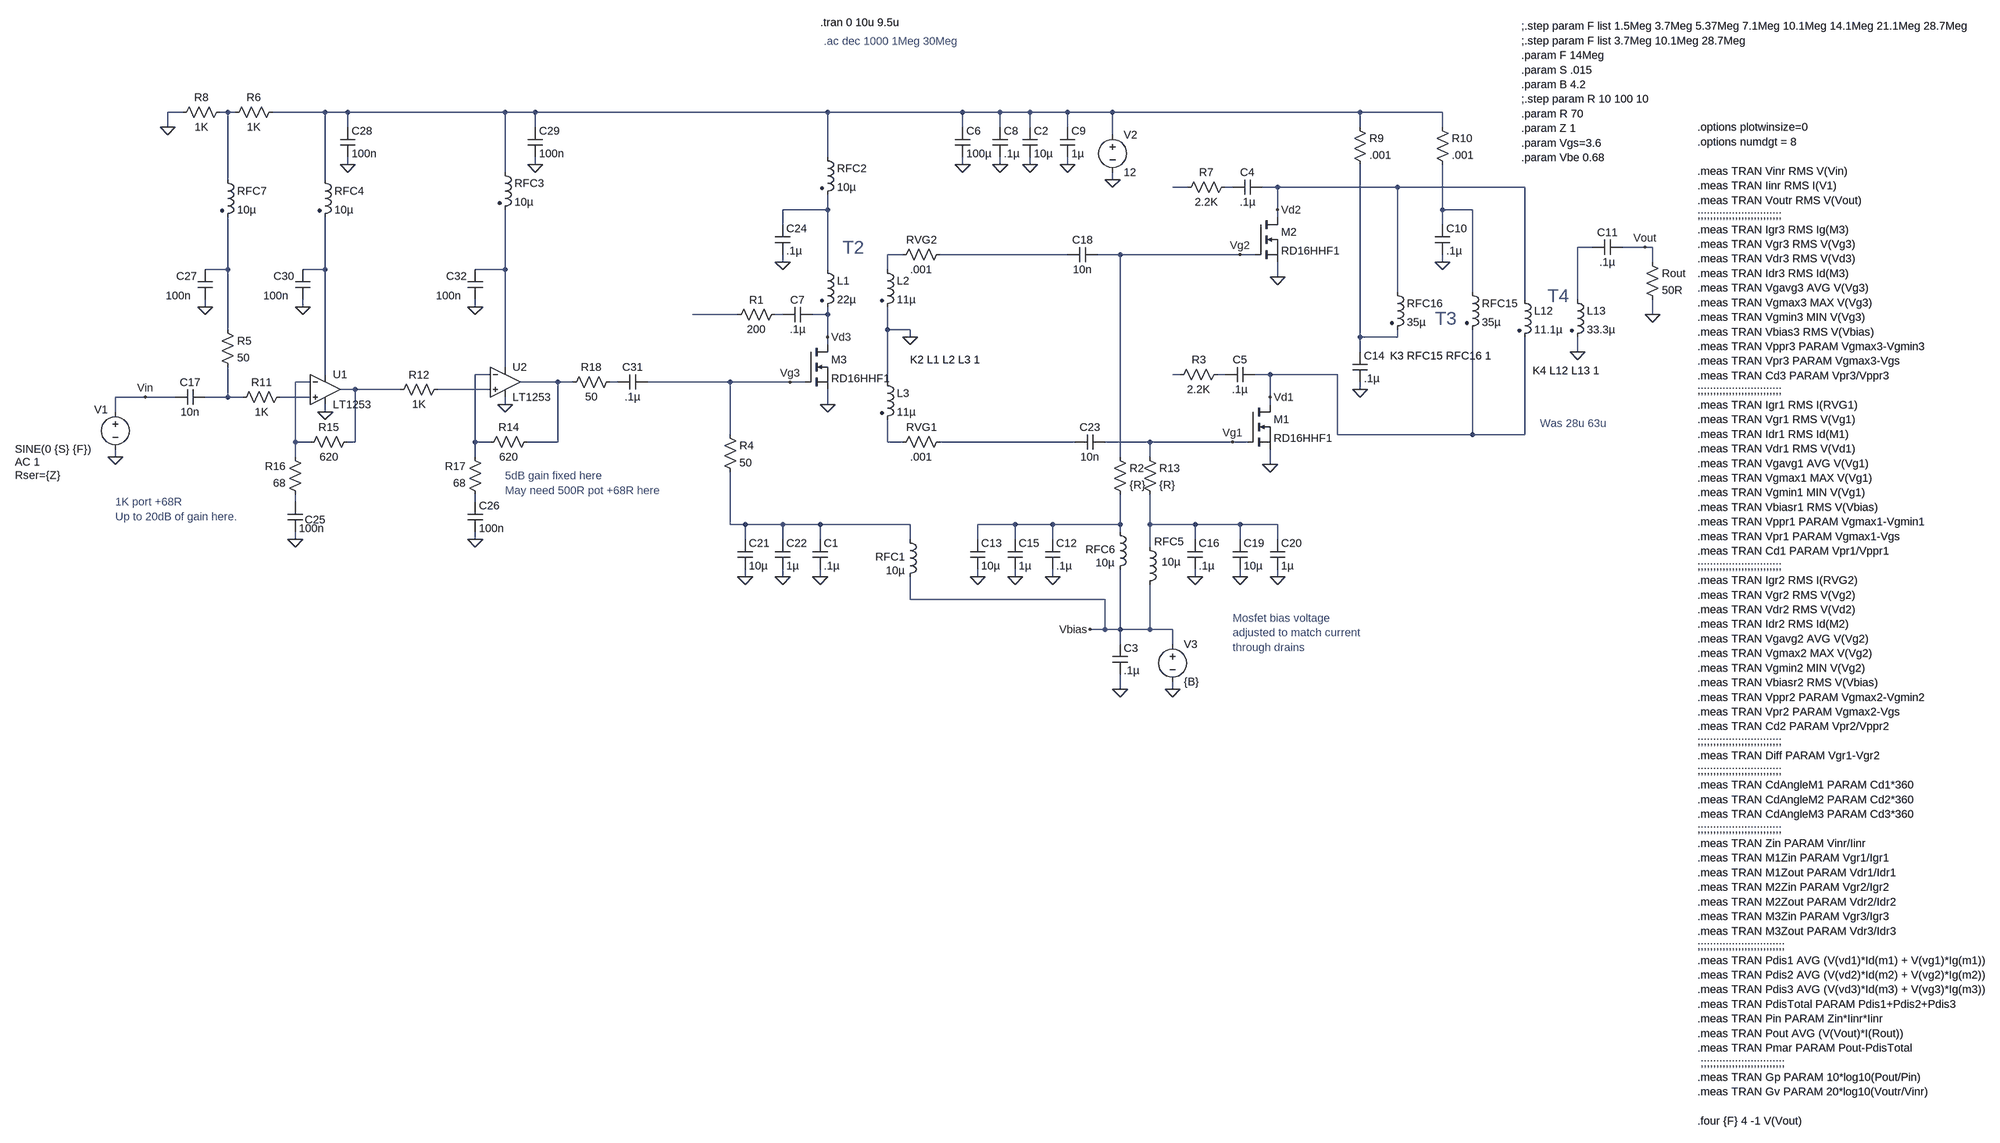
[diagram p0: schematic LT1253 2SC5706 RD16HHF Testing.asc]
LT1253 2SC5706 RD16HHF Testing.asc, the LTspice schematic file:
Version 4
SHEET 1 3748 1496
WIRE -880 -624 -912 -624
WIRE -784 -624 -800 -624
WIRE -768 -624 -784 -624
WIRE -576 -624 -688 -624
WIRE -528 -624 -576 -624
WIRE -192 -624 -528 -624
WIRE -128 -624 -192 -624
WIRE 496 -624 -128 -624
WIRE 784 -624 496 -624
WIRE 864 -624 784 -624
WIRE 928 -624 864 -624
WIRE 1008 -624 928 -624
WIRE 1104 -624 1008 -624
WIRE 1632 -624 1104 -624
WIRE 1808 -624 1632 -624
WIRE -912 -592 -912 -624
WIRE -528 -592 -528 -624
WIRE -128 -592 -128 -624
WIRE 784 -592 784 -624
WIRE 864 -592 864 -624
WIRE 928 -592 928 -624
WIRE 1008 -592 1008 -624
WIRE 1632 -592 1632 -624
WIRE 1808 -592 1808 -624
WIRE 1104 -576 1104 -624
WIRE 496 -528 496 -624
WIRE -528 -512 -528 -528
WIRE -128 -512 -128 -528
WIRE 784 -512 784 -528
WIRE 864 -512 864 -528
WIRE 928 -512 928 -528
WIRE 1008 -512 1008 -528
WIRE -192 -496 -192 -624
WIRE -784 -480 -784 -624
WIRE -576 -480 -576 -624
WIRE 1104 -480 1104 -496
WIRE 1264 -464 1232 -464
WIRE 1360 -464 1344 -464
WIRE 1456 -464 1424 -464
WIRE 1712 -464 1456 -464
WIRE 1984 -464 1712 -464
WIRE 496 -416 496 -448
WIRE 496 -416 400 -416
WIRE 1456 -416 1456 -464
WIRE 1808 -416 1808 -512
WIRE 1872 -416 1808 -416
WIRE 1456 -400 1456 -416
WIRE 400 -384 400 -416
WIRE 1808 -384 1808 -416
WIRE 2128 -336 2096 -336
WIRE 2240 -336 2192 -336
WIRE 2256 -336 2240 -336
WIRE 656 -320 624 -320
WIRE 1008 -320 736 -320
WIRE 1120 -320 1072 -320
WIRE 1376 -320 1120 -320
WIRE 1408 -320 1376 -320
WIRE 400 -304 400 -320
WIRE 1808 -304 1808 -320
WIRE 2256 -304 2256 -336
WIRE -784 -288 -784 -400
WIRE -784 -288 -832 -288
WIRE -576 -288 -576 -400
WIRE -576 -288 -624 -288
WIRE -192 -288 -192 -416
WIRE -192 -288 -256 -288
WIRE 496 -288 496 -416
WIRE 624 -288 624 -320
WIRE 1456 -272 1456 -304
WIRE 1712 -240 1712 -464
WIRE 1872 -240 1872 -416
WIRE 1984 -224 1984 -464
WIRE 2096 -224 2096 -336
WIRE -832 -208 -832 -224
WIRE -624 -208 -624 -224
WIRE -256 -208 -256 -224
WIRE 304 -192 208 -192
WIRE 400 -192 384 -192
WIRE 496 -192 496 -208
WIRE 496 -192 464 -192
WIRE 2256 -192 2256 -224
WIRE -784 -160 -784 -288
WIRE 624 -160 624 -208
WIRE 672 -160 624 -160
WIRE 496 -144 496 -192
WIRE 672 -144 672 -160
WIRE 1632 -144 1632 -512
WIRE 1712 -144 1712 -160
WIRE 1712 -144 1632 -144
WIRE 496 -128 496 -144
WIRE 1632 -112 1632 -144
WIRE 2096 -112 2096 -144
WIRE -192 -80 -192 -288
WIRE -576 -64 -576 -288
WIRE -224 -64 -256 -64
WIRE 1248 -64 1232 -64
WIRE 1344 -64 1328 -64
WIRE 1440 -64 1408 -64
WIRE 1584 -64 1440 -64
WIRE -608 -48 -640 -48
WIRE -80 -48 -160 -48
WIRE -48 -48 -80 -48
WIRE 48 -48 32 -48
WIRE 288 -48 112 -48
WIRE 416 -48 288 -48
WIRE 448 -48 416 -48
WIRE 624 -48 624 -160
WIRE -512 -32 -544 -32
WIRE -416 -32 -512 -32
WIRE -224 -32 -336 -32
WIRE 1632 -32 1632 -48
WIRE -960 -16 -1024 -16
WIRE -896 -16 -960 -16
WIRE -784 -16 -784 -80
WIRE -784 -16 -832 -16
WIRE -752 -16 -784 -16
WIRE -608 -16 -672 -16
WIRE 1440 -16 1440 -64
WIRE -192 0 -192 -16
WIRE 496 0 496 -32
WIRE 1440 0 1440 -16
WIRE -1024 16 -1024 -16
WIRE -576 16 -576 0
WIRE 288 64 288 -48
WIRE 1584 64 1584 -64
WIRE 1872 64 1872 -160
WIRE 1872 64 1584 64
WIRE 1984 64 1984 -144
WIRE 1984 64 1872 64
WIRE -640 80 -640 -48
WIRE -608 80 -640 80
WIRE -512 80 -512 -32
WIRE -512 80 -528 80
WIRE -256 80 -256 -64
WIRE -224 80 -256 80
WIRE -80 80 -80 -48
WIRE -80 80 -144 80
WIRE 624 80 624 32
WIRE 656 80 624 80
WIRE 1024 80 736 80
WIRE 1184 80 1088 80
WIRE 1360 80 1184 80
WIRE 1392 80 1360 80
WIRE -1024 112 -1024 96
WIRE -640 112 -640 80
WIRE -256 112 -256 80
WIRE 1120 112 1120 -320
WIRE 1184 112 1184 80
WIRE 1440 128 1440 96
WIRE -640 208 -640 192
WIRE -256 208 -256 192
WIRE 288 256 288 144
WIRE 320 256 288 256
WIRE 400 256 320 256
WIRE 480 256 400 256
WIRE 672 256 480 256
WIRE 896 256 816 256
WIRE 976 256 896 256
WIRE 1120 256 1120 192
WIRE 1120 256 976 256
WIRE 1184 256 1184 192
WIRE 1280 256 1184 256
WIRE 1376 256 1280 256
WIRE 1456 256 1376 256
WIRE 1120 272 1120 256
WIRE -640 288 -640 272
WIRE -256 288 -256 272
WIRE 320 288 320 256
WIRE 400 288 400 256
WIRE 480 288 480 256
WIRE 672 288 672 256
WIRE 816 288 816 256
WIRE 896 288 896 256
WIRE 976 288 976 256
WIRE 1280 288 1280 256
WIRE 1376 288 1376 256
WIRE 1456 288 1456 256
WIRE 1184 304 1184 256
WIRE 320 368 320 352
WIRE 400 368 400 352
WIRE 480 368 480 352
WIRE 816 368 816 352
WIRE 896 368 896 352
WIRE 976 368 976 352
WIRE 1280 368 1280 352
WIRE 1376 368 1376 352
WIRE 1456 368 1456 352
WIRE 672 416 672 368
WIRE 1088 416 672 416
WIRE 1088 480 1088 416
WIRE 1088 480 1056 480
WIRE 1120 480 1120 352
WIRE 1120 480 1088 480
WIRE 1184 480 1184 384
WIRE 1184 480 1120 480
WIRE 1232 480 1184 480
WIRE 1120 512 1120 480
WIRE 1232 512 1232 480
WIRE 1120 608 1120 576
WIRE 1232 608 1232 592
FLAG 1104 -480 0
FLAG -1024 112 0
FLAG 2240 -336 Vout
FLAG -960 -16 Vin
FLAG 928 -512 0
FLAG 1008 -512 0
FLAG 784 -512 0
FLAG 864 -512 0
FLAG 1232 608 0
FLAG 1440 128 0
FLAG 1360 80 Vg1
FLAG 1440 -16 Vd1
FLAG 1120 608 0
FLAG 1056 480 Vbias
FLAG 1456 -272 0
FLAG 1376 -320 Vg2
FLAG 1456 -416 Vd2
FLAG 1808 -304 0
FLAG 2096 -112 0
FLAG 2256 -192 0
FLAG 1632 -32 0
FLAG 480 368 0
FLAG 1280 368 0
FLAG 1376 368 0
FLAG 1456 368 0
FLAG 320 368 0
FLAG 400 368 0
FLAG 496 0 0
FLAG 416 -48 Vg3
FLAG 496 -144 Vd3
FLAG 976 368 0
FLAG 816 368 0
FLAG 896 368 0
FLAG 400 -304 0
FLAG 672 -144 0
FLAG -528 -512 0
FLAG -832 -208 0
FLAG -576 16 0
FLAG -192 0 0
FLAG -256 288 0
FLAG -128 -512 0
FLAG -912 -592 0
FLAG -640 288 0
FLAG -624 -208 0
FLAG -256 -208 0
SYMBOL voltage -1024 0 R0
WINDOW 0 -45 11 Left 2
WINDOW 3 -214 95 Left 2
WINDOW 123 -214 123 Left 2
WINDOW 39 -214 151 Left 2
SYMATTR InstName V1
SYMATTR Value SINE(0 {S} {F})
SYMATTR Value2 AC 1
SYMATTR SpiceLine Rser={Z}
SYMBOL voltage 1104 -592 R0
WINDOW 123 0 0 Left 0
WINDOW 39 0 0 Left 0
SYMATTR InstName V2
SYMATTR Value 12
SYMBOL res 2240 -320 R0
SYMATTR InstName Rout
SYMATTR Value 50R
SYMBOL ind2 608 -304 R0
SYMATTR InstName L2
SYMATTR Value 11µ
SYMATTR Type ind
SYMBOL cap 912 -592 R0
SYMATTR InstName C2
SYMATTR Value 10µ
SYMBOL cap 992 -592 R0
SYMATTR InstName C9
SYMATTR Value 1µ
SYMBOL cap 768 -592 R0
SYMATTR InstName C6
SYMATTR Value 100µ
SYMBOL cap 848 -592 R0
SYMATTR InstName C8
SYMATTR Value .1µ
SYMBOL voltage 1232 496 R0
WINDOW 123 0 0 Left 2
WINDOW 39 0 0 Left 2
SYMATTR InstName V3
SYMATTR Value {B}
SYMBOL res 1104 96 R0
SYMATTR InstName R2
SYMATTR Value {R}
SYMBOL nmos 1392 0 R0
SYMATTR InstName M1
SYMATTR Value RD16HHF1
SYMBOL cap 1104 512 R0
SYMATTR InstName C3
SYMATTR Value .1µ
SYMBOL nmos 1408 -400 R0
SYMATTR InstName M2
SYMATTR Value RD16HHF1
SYMBOL ind2 1968 -240 R0
SYMATTR InstName L12
SYMATTR Value 11.1µ
SYMATTR Type ind
SYMBOL ind2 1856 -256 R0
SYMATTR InstName RFC15
SYMATTR Value 35µ
SYMATTR Type ind
SYMBOL cap 1792 -384 R0
SYMATTR InstName C10
SYMATTR Value .1µ
SYMBOL cap 2192 -352 R90
WINDOW 0 0 32 VBottom 2
WINDOW 3 32 32 VTop 2
SYMATTR InstName C11
SYMATTR Value .1µ
SYMBOL cap 1616 -112 R0
SYMATTR InstName C14
SYMATTR Value .1µ
SYMBOL ind2 1696 -256 R0
SYMATTR InstName RFC16
SYMATTR Value 35µ
SYMATTR Type ind
SYMBOL ind2 2080 -240 R0
SYMATTR InstName L13
SYMATTR Value 33.3µ
SYMATTR Type ind
SYMBOL res 1616 -608 R0
SYMATTR InstName R9
SYMATTR Value .001
SYMBOL res 1792 -608 R0
SYMATTR InstName R10
SYMATTR Value .001
SYMBOL res 752 64 R90
WINDOW 0 0 56 VBottom 2
WINDOW 3 32 56 VTop 2
SYMATTR InstName RVG1
SYMATTR Value .001
SYMBOL res 752 -336 R90
WINDOW 0 0 56 VBottom 2
WINDOW 3 32 56 VTop 2
SYMATTR InstName RVG2
SYMATTR Value .001
SYMBOL cap 1424 -480 R90
WINDOW 0 0 32 VBottom 2
WINDOW 3 32 32 VTop 2
SYMATTR InstName C4
SYMATTR Value .1µ
SYMBOL cap 1408 -80 R90
WINDOW 0 0 32 VBottom 2
WINDOW 3 32 32 VTop 2
SYMATTR InstName C5
SYMATTR Value .1µ
SYMBOL res 1344 -80 R90
WINDOW 0 0 56 VBottom 2
WINDOW 3 32 56 VTop 2
SYMATTR InstName R3
SYMATTR Value 2.2K
SYMBOL res 1360 -480 R90
WINDOW 0 0 56 VBottom 2
WINDOW 3 32 56 VTop 2
SYMATTR InstName R7
SYMATTR Value 2.2K
SYMBOL res 1168 96 R0
SYMATTR InstName R13
SYMATTR Value {R}
SYMBOL ind 1168 288 R0
WINDOW 0 25 5 Left 2
WINDOW 3 41 48 Left 2
SYMATTR InstName RFC5
SYMATTR Value 10µ
SYMBOL ind 1104 256 R0
WINDOW 0 -58 53 Left 2
WINDOW 3 -36 82 Left 2
SYMATTR InstName RFC6
SYMATTR Value 10µ
SYMBOL cap 464 288 R0
SYMATTR InstName C1
SYMATTR Value .1µ
SYMBOL cap 1264 288 R0
SYMATTR InstName C16
SYMATTR Value .1µ
SYMBOL cap 1360 288 R0
SYMATTR InstName C19
SYMATTR Value 10µ
SYMBOL cap 1440 288 R0
SYMATTR InstName C20
SYMATTR Value 1µ
SYMBOL cap 304 288 R0
SYMATTR InstName C21
SYMATTR Value 10µ
SYMBOL cap 384 288 R0
SYMATTR InstName C22
SYMATTR Value 1µ
SYMBOL nmos 448 -128 R0
SYMATTR InstName M3
SYMATTR Value RD16HHF1
SYMBOL cap 464 -208 R90
WINDOW 0 0 32 VBottom 2
WINDOW 3 32 32 VTop 2
SYMATTR InstName C7
SYMATTR Value .1µ
SYMBOL res 400 -208 R90
WINDOW 0 0 56 VBottom 2
WINDOW 3 32 56 VTop 2
SYMATTR InstName R1
SYMATTR Value 200
SYMBOL ind2 480 -304 R0
SYMATTR InstName L1
SYMATTR Value 22µ
SYMATTR Type ind
SYMBOL res 272 48 R0
SYMATTR InstName R4
SYMATTR Value 50
SYMBOL cap 960 288 R0
SYMATTR InstName C12
SYMATTR Value .1µ
SYMBOL cap 800 288 R0
SYMATTR InstName C13
SYMATTR Value 10µ
SYMBOL cap 880 288 R0
SYMATTR InstName C15
SYMATTR Value 1µ
SYMBOL cap -832 -32 R90
WINDOW 0 0 32 VBottom 2
WINDOW 3 32 32 VTop 2
SYMATTR InstName C17
SYMATTR Value 10n
SYMBOL cap 1072 -336 R90
WINDOW 0 0 32 VBottom 2
WINDOW 3 32 32 VTop 2
SYMATTR InstName C18
SYMATTR Value 10n
SYMBOL cap 1088 64 R90
WINDOW 0 0 32 VBottom 2
WINDOW 3 32 32 VTop 2
SYMATTR InstName C23
SYMATTR Value 10n
SYMBOL ind 656 272 R0
WINDOW 0 -58 53 Left 2
WINDOW 3 -36 82 Left 2
SYMATTR InstName RFC1
SYMATTR Value 10µ
SYMBOL ind2 480 -544 R0
SYMATTR InstName RFC2
SYMATTR Value 10µ
SYMATTR Type ind
SYMBOL cap 384 -384 R0
SYMATTR InstName C24
SYMATTR Value .1µ
SYMBOL ind2 608 -64 R0
SYMATTR InstName L3
SYMATTR Value 11µ
SYMATTR Type ind
SYMBOL Opamps\\LT1253 -576 -96 R0
SYMATTR InstName U1
SYMBOL Opamps\\LT1253 -192 -112 R0
SYMATTR InstName U2
SYMBOL res -800 -176 R0
SYMATTR InstName R5
SYMATTR Value 50
SYMBOL res -672 -640 R90
WINDOW 0 0 56 VBottom 2
WINDOW 3 32 56 VTop 2
SYMATTR InstName R6
SYMATTR Value 1K
SYMBOL res -784 -640 R90
WINDOW 0 0 56 VBottom 2
WINDOW 3 32 56 VTop 2
SYMATTR InstName R8
SYMATTR Value 1K
SYMBOL res -656 -32 R90
WINDOW 0 0 56 VBottom 2
WINDOW 3 32 56 VTop 2
SYMATTR InstName R11
SYMATTR Value 1K
SYMBOL res -320 -48 R90
WINDOW 0 0 56 VBottom 2
WINDOW 3 32 56 VTop 2
SYMATTR InstName R12
SYMATTR Value 1K
SYMBOL res -128 64 R90
WINDOW 0 0 56 VBottom 2
WINDOW 3 32 56 VTop 2
SYMATTR InstName R14
SYMATTR Value 620
SYMBOL res -512 64 R90
WINDOW 0 0 56 VBottom 2
WINDOW 3 32 56 VTop 2
SYMATTR InstName R15
SYMATTR Value 620
SYMBOL res -624 208 R180
WINDOW 0 36 76 Left 2
WINDOW 3 36 40 Left 2
SYMATTR InstName R16
SYMATTR Value 68
SYMBOL res -240 208 R180
WINDOW 0 36 76 Left 2
WINDOW 3 36 40 Left 2
SYMATTR InstName R17
SYMATTR Value 68
SYMBOL cap -656 208 R0
WINDOW 0 36 38 Left 2
SYMATTR InstName C25
SYMATTR Value 100n
SYMBOL cap -272 208 R0
SYMATTR InstName C26
SYMATTR Value 100n
SYMBOL cap -848 -288 R0
WINDOW 0 -46 14 Left 2
WINDOW 3 -68 56 Left 2
SYMATTR InstName C27
SYMATTR Value 100n
SYMBOL cap -544 -592 R0
SYMATTR InstName C28
SYMATTR Value 100n
SYMBOL cap -144 -592 R0
SYMATTR InstName C29
SYMATTR Value 100n
SYMBOL res 48 -64 R90
WINDOW 0 0 56 VBottom 2
WINDOW 3 32 56 VTop 2
SYMATTR InstName R18
SYMATTR Value 50
SYMBOL cap 112 -64 R90
WINDOW 0 0 32 VBottom 2
WINDOW 3 32 32 VTop 2
SYMATTR InstName C31
SYMATTR Value .1µ
SYMBOL ind2 -208 -512 R0
SYMATTR InstName RFC3
SYMATTR Value 10µ
SYMATTR Type ind
SYMBOL ind2 -592 -496 R0
SYMATTR InstName RFC4
SYMATTR Value 10µ
SYMATTR Type ind
SYMBOL ind2 -800 -496 R0
SYMATTR InstName RFC7
SYMATTR Value 10µ
SYMATTR Type ind
SYMBOL cap -640 -288 R0
WINDOW 0 -46 14 Left 2
WINDOW 3 -68 56 Left 2
SYMATTR InstName C30
SYMATTR Value 100n
SYMBOL cap -272 -288 R0
WINDOW 0 -46 14 Left 2
WINDOW 3 -68 56 Left 2
SYMATTR InstName C32
SYMATTR Value 100n
TEXT 480 -816 Left 2 !.tran 0 10u 9.5u
TEXT 2352 -592 Left 2 !.options plotwinsize=0\n.options numdgt = 8\n \n.meas TRAN Vinr RMS V(Vin)\n.meas TRAN Iinr RMS I(V1)\n.meas TRAN Voutr RMS V(Vout)\n;;;;;;;;;;;;;;;;;;;;;;;;;;;\n.meas TRAN Igr3 RMS Ig(M3)\n.meas TRAN Vgr3 RMS V(Vg3)\n.meas TRAN Vdr3 RMS V(Vd3)\n.meas TRAN Idr3 RMS Id(M3)\n.meas TRAN Vgavg3 AVG V(Vg3)\n.meas TRAN Vgmax3 MAX V(Vg3)\n.meas TRAN Vgmin3 MIN V(Vg3)\n.meas TRAN Vbias3 RMS V(Vbias)\n.meas TRAN Vppr3 PARAM Vgmax3-Vgmin3\n.meas TRAN Vpr3 PARAM Vgmax3-Vgs\n.meas TRAN Cd3 PARAM Vpr3/Vppr3\n;;;;;;;;;;;;;;;;;;;;;;;;;;;\n.meas TRAN Igr1 RMS I(RVG1)\n.meas TRAN Vgr1 RMS V(Vg1)\n.meas TRAN Idr1 RMS Id(M1)\n.meas TRAN Vdr1 RMS V(Vd1)\n.meas TRAN Vgavg1 AVG V(Vg1)\n.meas TRAN Vgmax1 MAX V(Vg1)\n.meas TRAN Vgmin1 MIN V(Vg1)\n.meas TRAN Vbiasr1 RMS V(Vbias)\n.meas TRAN Vppr1 PARAM Vgmax1-Vgmin1\n.meas TRAN Vpr1 PARAM Vgmax1-Vgs\n.meas TRAN Cd1 PARAM Vpr1/Vppr1\n;;;;;;;;;;;;;;;;;;;;;;;;;;;\n.meas TRAN Igr2 RMS I(RVG2)\n.meas TRAN Vgr2 RMS V(Vg2)\n.meas TRAN Vdr2 RMS V(Vd2)\n.meas TRAN Idr2 RMS Id(M2)\n.meas TRAN Vgavg2 AVG V(Vg2)\n.meas TRAN Vgmax2 MAX V(Vg2)\n.meas TRAN Vgmin2 MIN V(Vg2)\n.meas TRAN Vbiasr2 RMS V(Vbias)\n.meas TRAN Vppr2 PARAM Vgmax2-Vgmin2\n.meas TRAN Vpr2 PARAM Vgmax2-Vgs\n.meas TRAN Cd2 PARAM Vpr2/Vppr2\n;;;;;;;;;;;;;;;;;;;;;;;;;;;\n.meas TRAN Diff PARAM Vgr1-Vgr2 \n;;;;;;;;;;;;;;;;;;;;;;;;;;;\n.meas TRAN CdAngleM1 PARAM Cd1*360\n.meas TRAN CdAngleM2 PARAM Cd2*360\n.meas TRAN CdAngleM3 PARAM Cd3*360\n;;;;;;;;;;;;;;;;;;;;;;;;;;;\n.meas TRAN Zin PARAM Vinr/Iinr \n.meas TRAN M1Zin PARAM Vgr1/Igr1 \n.meas TRAN M1Zout PARAM Vdr1/Idr1 \n.meas TRAN M2Zin PARAM Vgr2/Igr2 \n.meas TRAN M2Zout PARAM Vdr2/Idr2 \n.meas TRAN M3Zin PARAM Vgr3/Igr3 \n.meas TRAN M3Zout PARAM Vdr3/Idr3 \n;;;;;;;;;;;;;;;;;;;;;;;;;;;;\n.meas TRAN Pdis1 AVG (V(vd1)*Id(m1) + V(vg1)*Ig(m1))\n.meas TRAN Pdis2 AVG (V(vd2)*Id(m2) + V(vg2)*Ig(m2))\n.meas TRAN Pdis3 AVG (V(vd3)*Id(m3) + V(vg3)*Ig(m3))\n.meas TRAN PdisTotal PARAM Pdis1+Pdis2+Pdis3\n.meas TRAN Pin PARAM Zin*Iinr*Iinr\n.meas TRAN Pout AVG (V(Vout)*I(Rout))\n.meas TRAN Pmar PARAM Pout-PdisTotal\n ;;;;;;;;;;;;;;;;;;;;;;;;;;;\n.meas TRAN Gp PARAM 10*log10(Pout/Pin)\n.meas TRAN Gv PARAM 20*log10(Voutr/Vinr)\n \n.four {F} 4 -1 V(Vout)
TEXT 1976 -808 Left 2 !;.step param F list 1.5Meg 3.7Meg 5.37Meg 7.1Meg 10.1Meg 14.1Meg 21.1Meg 28.7Meg\n;.step param F list 3.7Meg 10.1Meg 28.7Meg\n.param F 14Meg\n.param S .015\n.param B 4.2\n;.step param R 10 100 10\n.param R 70\n.param Z 1\n.param Vgs=3.6\n.param Vbe 0.68
TEXT 488 -776 Left 2 ;.ac dec 1000 1Meg 30Meg
TEXT 672 -96 Left 2 !K2 L1 L2 L3 1
TEXT 2000 -72 Left 2 !K4 L12 L13 1
TEXT 1696 -104 Left 2 !K3 RFC15 RFC16 1
TEXT 2016 40 Left 2 ;Was 28u 63u
TEXT 1360 456 Left 2 ;Mosfet bias voltage\nadjusted to match current\nthrough drains
TEXT 528 -336 Left 4 ;T2
TEXT 1792 -184 Left 4 ;T3
TEXT 2032 -232 Left 4 ;T4
TEXT -192 152 Left 2 ;5dB gain fixed here\nMay need 500R pot +68R here
TEXT -1024 208 Left 2 ;1K port +68R  \nUp to 20dB of gain here.

The netlist it stands for:
* LT1253 2SC5706 RD16HHF Testing.asc
V1 Vin 0 SINE(0 {S} {F}) AC 1 Rser={Z}
V2 N002 0 12
Rout Vout 0 50R
L2 N008 0 11µ
C2 N002 0 10µ
C9 N002 0 1µ
C6 N002 0 100µ
C8 N002 0 .1µ
V3 Vbias 0 {B}
R2 Vg2 N031 {R}
M1 Vd1 Vg1 0 0 RD16HHF1
C3 Vbias 0 .1µ
M2 Vd2 Vg2 0 0 RD16HHF1
L12 Vd2 Vd1 11.1µ
L§RFC15 N006 Vd1 35µ
C10 N006 0 .1µ
C11 Vout N007 .1µ
C14 N015 0 .1µ
L§RFC16 Vd2 N015 35µ
L13 N007 0 33.3µ
R9 N002 N015 .001
R10 N002 N006 .001
RVG1 N027 N026 .001
RVG2 N009 N008 .001
C4 Vd2 N004 .1µ
C5 Vd1 N018 .1µ
R3 N018 N017 2.2K
R7 N004 N003 2.2K
R13 Vg1 N032 {R}
L§RFC5 N032 Vbias 10µ
L§RFC6 N031 Vbias 10µ
C1 N030 0 .1µ
C16 N032 0 .1µ
C19 N032 0 10µ
C20 N032 0 1µ
C21 N030 0 10µ
C22 N030 0 1µ
M3 Vd3 Vg3 0 0 RD16HHF1
C7 Vd3 N014 .1µ
R1 N014 N013 200
L1 N005 Vd3 22µ
R4 Vg3 N030 50
C12 N031 0 .1µ
C13 N031 0 10µ
C15 N031 0 1µ
C17 N024 Vin 10n
C18 Vg2 N009 10n
C23 Vg1 N027 10n
L§RFC1 N030 Vbias 10µ
L§RFC2 N002 N005 10µ
C24 N005 0 .1µ
L3 0 N026 11µ
XU1 N025 N019 N011 0 N022 LT1253  ; pins In+ In- V+ V- OUT
XU2 N023 N016 N012 0 N020 LT1253  ; pins In+ In- V+ V- OUT
R5 N010 N024 50
R6 N002 N001 1K
R8 N001 0 1K
R11 N025 N024 1K
R12 N023 N022 1K
R14 N020 N016 620
R15 N022 N019 620
R16 N028 N019 68
R17 N029 N016 68
C25 N028 0 100n
C26 N029 0 100n
C27 N010 0 100n
C28 N002 0 100n
C29 N002 0 100n
R18 N021 N020 50
C31 Vg3 N021 .1µ
L§RFC3 N002 N012 10µ
L§RFC4 N002 N011 10µ
L§RFC7 N001 N010 10µ
C30 N011 0 100n
C32 N012 0 100n
.model NMOS NMOS
.model PMOS PMOS
.lib standard.mos
.tran 0 10u 9.5u
.options plotwinsize=0
.options numdgt = 8
.meas TRAN Vinr RMS V(Vin)
.meas TRAN Iinr RMS I(V1)
.meas TRAN Voutr RMS V(Vout)
;;;;;;;;;;;;;;;;;;;;;;;;;;;
.meas TRAN Igr3 RMS Ig(M3)
.meas TRAN Vgr3 RMS V(Vg3)
.meas TRAN Vdr3 RMS V(Vd3)
.meas TRAN Idr3 RMS Id(M3)
.meas TRAN Vgavg3 AVG V(Vg3)
.meas TRAN Vgmax3 MAX V(Vg3)
.meas TRAN Vgmin3 MIN V(Vg3)
.meas TRAN Vbias3 RMS V(Vbias)
.meas TRAN Vppr3 PARAM Vgmax3-Vgmin3
.meas TRAN Vpr3 PARAM Vgmax3-Vgs
.meas TRAN Cd3 PARAM Vpr3/Vppr3
;;;;;;;;;;;;;;;;;;;;;;;;;;;
.meas TRAN Igr1 RMS I(RVG1)
.meas TRAN Vgr1 RMS V(Vg1)
.meas TRAN Idr1 RMS Id(M1)
.meas TRAN Vdr1 RMS V(Vd1)
.meas TRAN Vgavg1 AVG V(Vg1)
.meas TRAN Vgmax1 MAX V(Vg1)
.meas TRAN Vgmin1 MIN V(Vg1)
.meas TRAN Vbiasr1 RMS V(Vbias)
.meas TRAN Vppr1 PARAM Vgmax1-Vgmin1
.meas TRAN Vpr1 PARAM Vgmax1-Vgs
.meas TRAN Cd1 PARAM Vpr1/Vppr1
;;;;;;;;;;;;;;;;;;;;;;;;;;;
.meas TRAN Igr2 RMS I(RVG2)
.meas TRAN Vgr2 RMS V(Vg2)
.meas TRAN Vdr2 RMS V(Vd2)
.meas TRAN Idr2 RMS Id(M2)
.meas TRAN Vgavg2 AVG V(Vg2)
.meas TRAN Vgmax2 MAX V(Vg2)
.meas TRAN Vgmin2 MIN V(Vg2)
.meas TRAN Vbiasr2 RMS V(Vbias)
.meas TRAN Vppr2 PARAM Vgmax2-Vgmin2
.meas TRAN Vpr2 PARAM Vgmax2-Vgs
.meas TRAN Cd2 PARAM Vpr2/Vppr2
;;;;;;;;;;;;;;;;;;;;;;;;;;;
.meas TRAN Diff PARAM Vgr1-Vgr2
;;;;;;;;;;;;;;;;;;;;;;;;;;;
.meas TRAN CdAngleM1 PARAM Cd1*360
.meas TRAN CdAngleM2 PARAM Cd2*360
.meas TRAN CdAngleM3 PARAM Cd3*360
;;;;;;;;;;;;;;;;;;;;;;;;;;;
.meas TRAN Zin PARAM Vinr/Iinr
.meas TRAN M1Zin PARAM Vgr1/Igr1
.meas TRAN M1Zout PARAM Vdr1/Idr1
.meas TRAN M2Zin PARAM Vgr2/Igr2
.meas TRAN M2Zout PARAM Vdr2/Idr2
.meas TRAN M3Zin PARAM Vgr3/Igr3
.meas TRAN M3Zout PARAM Vdr3/Idr3
;;;;;;;;;;;;;;;;;;;;;;;;;;;;
.meas TRAN Pdis1 AVG (V(vd1)*Id(m1) + V(vg1)*Ig(m1))
.meas TRAN Pdis2 AVG (V(vd2)*Id(m2) + V(vg2)*Ig(m2))
.meas TRAN Pdis3 AVG (V(vd3)*Id(m3) + V(vg3)*Ig(m3))
.meas TRAN PdisTotal PARAM Pdis1+Pdis2+Pdis3
.meas TRAN Pin PARAM Zin*Iinr*Iinr
.meas TRAN Pout AVG (V(Vout)*I(Rout))
.meas TRAN Pmar PARAM Pout-PdisTotal
 ;;;;;;;;;;;;;;;;;;;;;;;;;;;
.meas TRAN Gp PARAM 10*log10(Pout/Pin)
.meas TRAN Gv PARAM 20*log10(Voutr/Vinr)
.four {F} 4 -1 V(Vout)
;.step param F list 1.5Meg 3.7Meg 5.37Meg 7.1Meg 10.1Meg 14.1Meg 21.1Meg 28.7Meg
;.step param F list 3.7Meg 10.1Meg 28.7Meg
.param F 14Meg
.param S .015
.param B 4.2
;.step param R 10 100 10
.param R 70
.param Z 1
.param Vgs=3.6
.param Vbe 0.68
* .ac dec 1000 1Meg 30Meg
K2 L1 L2 L3 1
K4 L12 L13 1
K3 RFC15 RFC16 1
* Was 28u 63u
* Mosfet bias voltage
* adjusted to match current
* through drains
* T2
* T3
* T4
* 5dB gain fixed here
* May need 500R pot +68R here
* 1K port +68R
* Up to 20dB of gain here.
.backanno
.end